# Altium schematic sheet PLD_Connectors.SchDoc: Connectors
size A3; ApprovedBy: Piotr Kuligowski; CheckedBy: Piotr Kuligowski; Author: Michał Gumiela; SheetNumber: 1; SheetTotal: 13
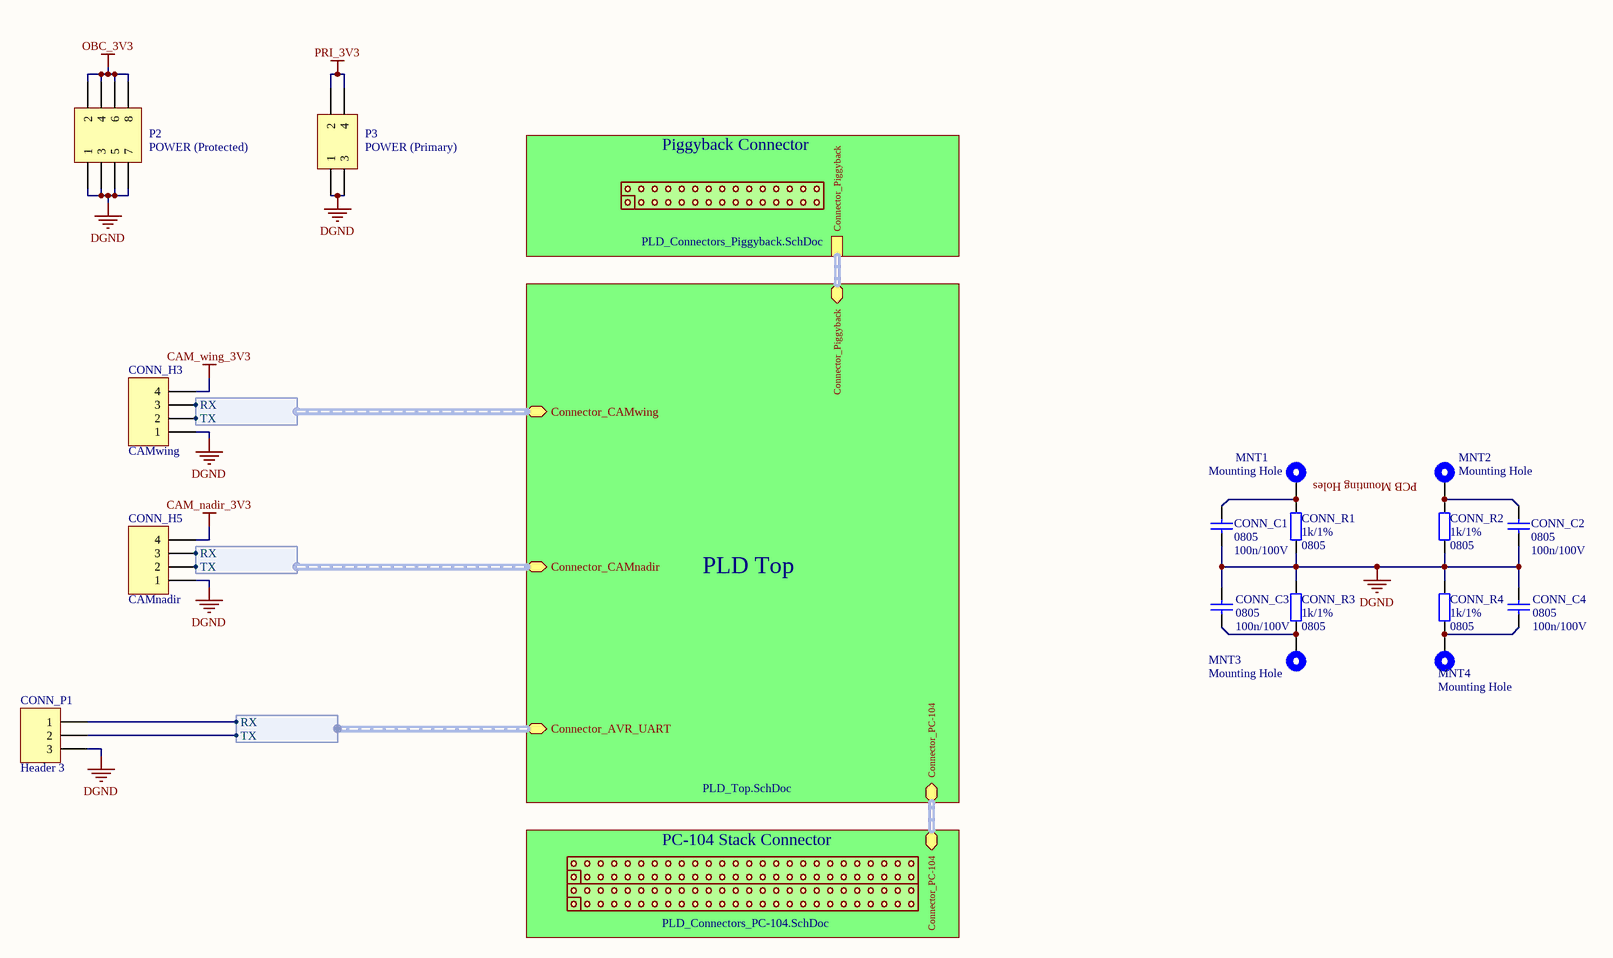
[diagram p0: PLD_Connectors.SchDoc]

## Parts
CONN_C1  Package: 0805  [SMD_Capacitor_0805]  (hidden comment: 100n/100V)
CONN_C2  Package: 0805  [SMD_Capacitor_0805]  (hidden comment: 100n/100V)
CONN_C3  Package: 0805  [SMD_Capacitor_0805]  (hidden comment: 100n/100V)
CONN_C4  Package: 0805  [SMD_Capacitor_0805]  (hidden comment: 100n/100V)
CONN_H3  CAMwing  [HEADER 1X4H Male]
CONN_H5  CAMnadir  [HEADER 1X4H Male]
CONN_P1  Header 3  [HEADER1X3H Male]
CONN_R1  Package: 0805  [SMD_Resistor_0805]  (hidden comment: 1k/1%)
CONN_R2  Package: 0805  [SMD_Resistor_0805]  (hidden comment: 1k/1%)
CONN_R3  Package: 0805  [SMD_Resistor_0805]  (hidden comment: 1k/1%)
CONN_R4  Package: 0805  [SMD_Resistor_0805]  (hidden comment: 1k/1%)
MNT1  Mounting Hole  [PC-104_PcbMntHole_M3]
MNT2  Mounting Hole  [PC-104_PcbMntHole_M3]
MNT3  Mounting Hole  [PC-104_PcbMntHole_M3]
MNT4  Mounting Hole  [PC-104_PcbMntHole_M3]
P2  POWER (Protected)  [HEADER 2X4 MALE]
P3  POWER (Primary)  [HDR2X2]

## Sub-sheets
PC-104 Stack Connector = PLD_Connectors_PC-104.SchDoc: Connector_PC-104 (harness Connector_PC-104)
Piggyback Connector = PLD_Connectors_Piggyback.SchDoc: Connector_Piggyback (harness Connector_Piggyback)
PLD Top = PLD_Top.SchDoc: Connector_PC-104 (harness Connector_PC-104), Connector_Piggyback (harness Connector_Piggyback), Connector_CAMnadir (harness CAM), Connector_CAMwing (harness CAM), Connector_AVR_UART (harness UART)

## Harnesses
CAM: TX, RX
UART: TX, RX

## Nets
CAM_nadir_3V3: CONN_H5.4
CAM_wing_3V3: CONN_H3.4
DGND: CONN_C1.1 CONN_C2.1 CONN_C3.2 CONN_C4.2 CONN_H3.1 CONN_H5.1 CONN_P1.3 CONN_R1.1 CONN_R2.1 CONN_R3.2 CONN_R4.2 P2.1 P2.3 P2.5 P2.7 P3.1 P3.3
OBC_3V3: P2.2 P2.4 P2.6 P2.8
PRI_3V3: P3.2 P3.4
NetCONN_C1_2: CONN_C1.2 CONN_R1.2 MNT1.1
NetCONN_C2_2: CONN_C2.2 CONN_R2.2 MNT2.1
NetCONN_C3_1: CONN_C3.1 CONN_R3.1 MNT3.1
NetCONN_C4_1: CONN_C4.1 CONN_R4.1 MNT4.1
NetCONN_H3_2: CONN_H3.2 ; sheet PLD Top/Connector_CAMwing.TX
NetCONN_H3_3: CONN_H3.3 ; sheet PLD Top/Connector_CAMwing.RX
NetCONN_H5_2: CONN_H5.2 ; sheet PLD Top/Connector_CAMnadir.TX
NetCONN_H5_3: CONN_H5.3 ; sheet PLD Top/Connector_CAMnadir.RX
NetCONN_P1_1: CONN_P1.1 ; sheet PLD Top/Connector_AVR_UART.RX
NetCONN_P1_2: CONN_P1.2 ; sheet PLD Top/Connector_AVR_UART.TX

## Buses and harness runs
harness sheet PC-104 Stack Connector/Connector_PC-104 = sheet PLD Top/Connector_PC-104
harness sheet Piggyback Connector/Connector_Piggyback = sheet PLD Top/Connector_Piggyback

## Notes on the sheet
- (near MNT1) PCB Mounting Holes
- Title:
- Project:
- Author:
- Model:
- Document Number:
- Checked by:
- Rev:
- Date:
- Approved by:
- Sheet:
- of
- File name:

## Library data of the parts
CONN_C1-CONN_C4 = Cer_C0805T104K1RCLTU: Ceramic Cap Kemet COTS 100n/100V X7R 0805; ManufacturerPartNumber: C0805T104K1RCLTU; Manufacturer: Kemet; Value: 100n/100V
CONN_H3 CONN_H5 = Header 4: Header, 4-Pin; LatestRevisionDate: 17-Jul-2002; LatestRevisionNote: Re-released for DXP Platform.; Publisher: Altium Limited
CONN_P1 = Header 3: Header, 3-Pin; LatestRevisionDate: 17-Jul-2002; LatestRevisionNote: Re-released for DXP Platform.; Publisher: Altium Limited
CONN_R1-CONN_R4 = CRCW08051K00FKxxxx: 1k/1% Vishay CRCW 0805 Resistor. 125mW, 100ppm, 150V.; Manufacturer: Vishay; ManufacturerPartNumber: CRCW08051K00FKxxxx; Value: 1k/1%
MNT1-MNT4 = MntHole: PCB Mounting Hole; Value: Mounting Hole
P2 = Header 4X2: Header, 4-Pin, Dual row; LatestRevisionDate: 17-Jul-2002; LatestRevisionNote: Re-released for DXP Platform.; Publisher: Altium Limited
P3 = Header 2X2: Header, 2-Pin, Dual row; LatestRevisionDate: 17-Jul-2002; LatestRevisionNote: Re-released for DXP Platform.; Publisher: Altium Limited